# EAGLE design Dice-v1 (EAGLE 7.7.0)
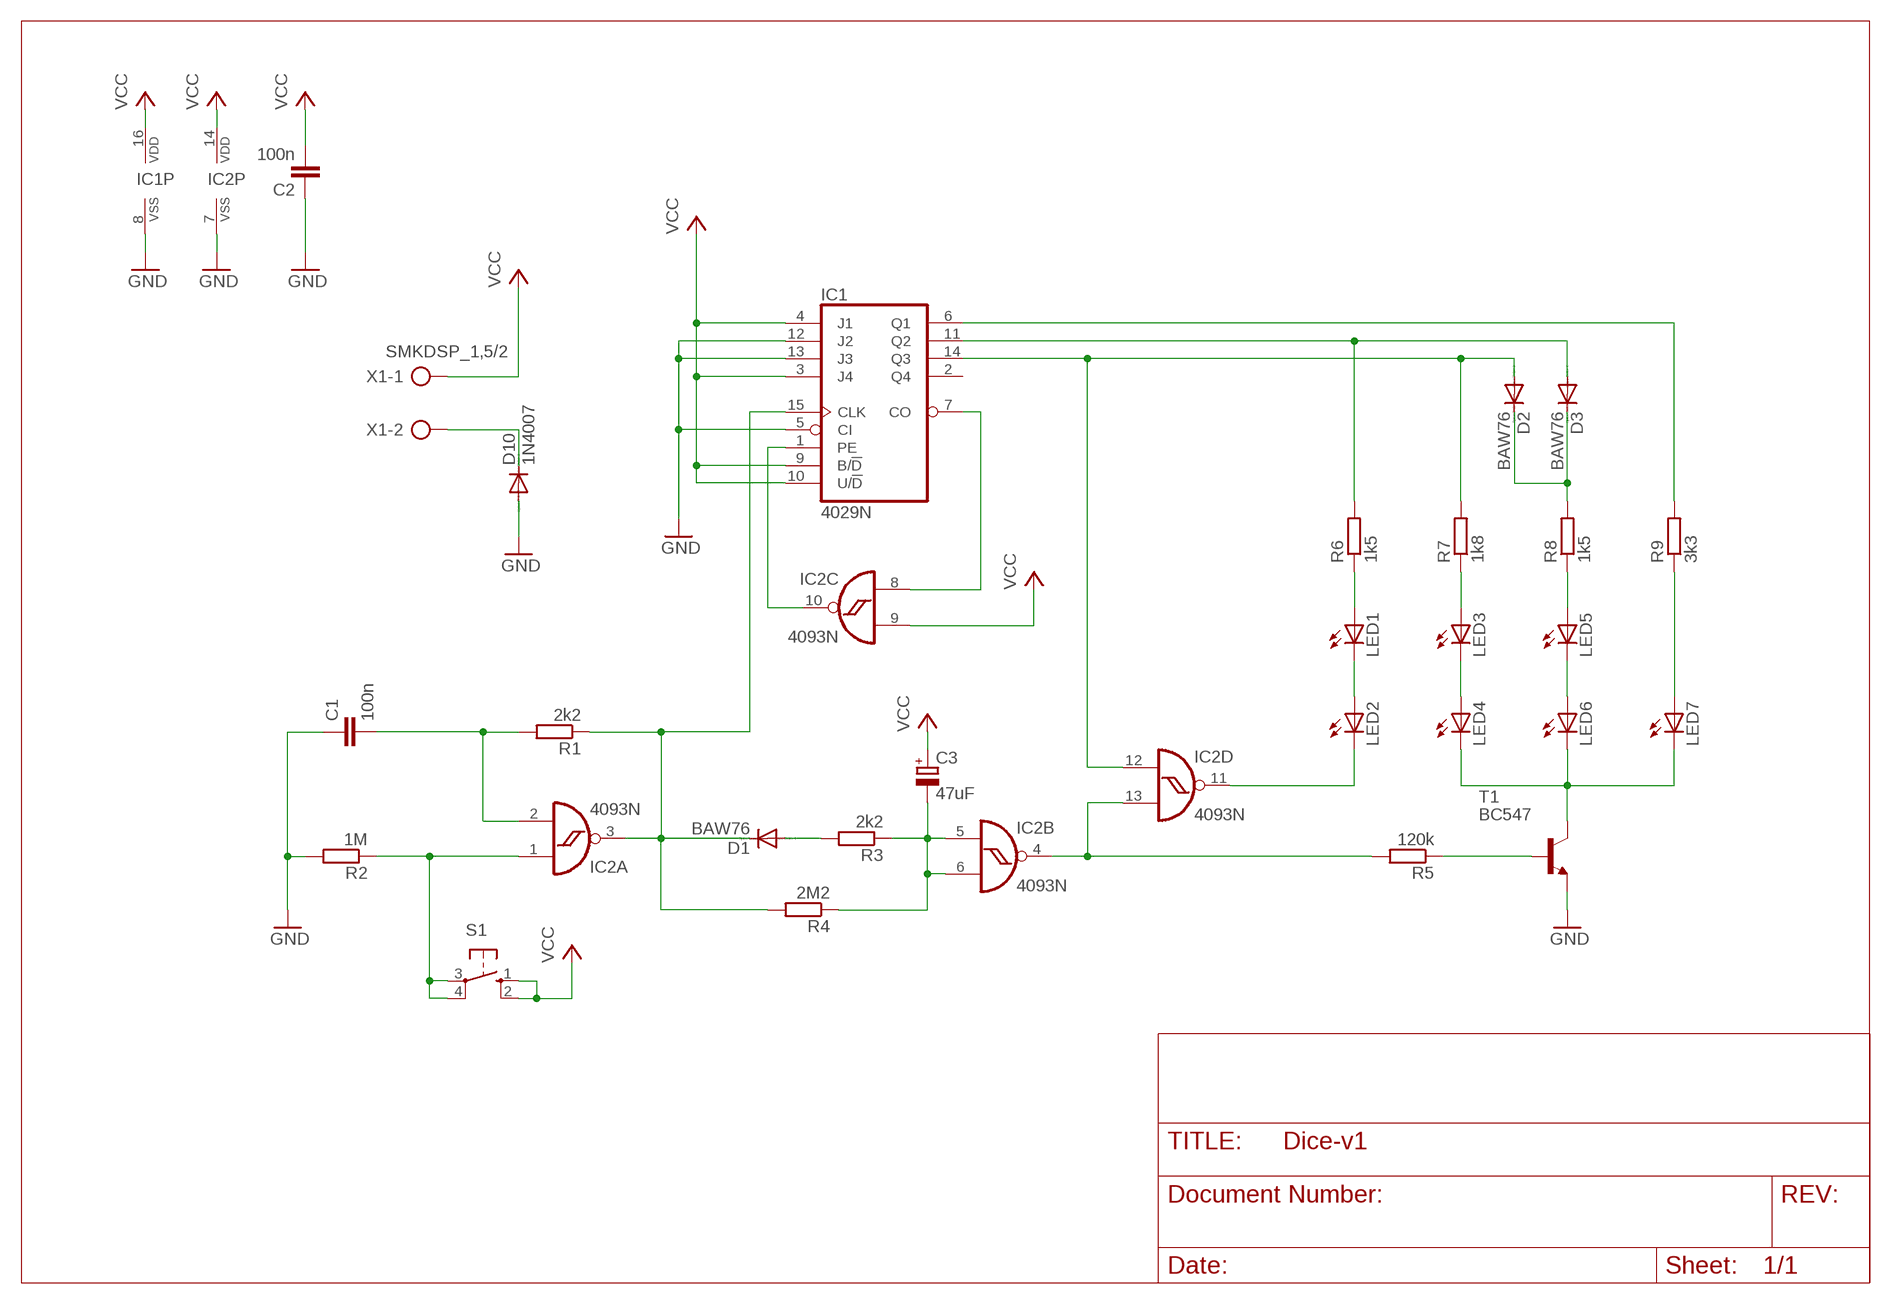
[diagram p0: schematic, sheet 1]

## Parts
C1  100n  C-EU050-025X075  [C050-025X075]
C2  100n  C-EU050-025X075  [C050-025X075]
C3  47uF  CPOL-EUE2-5  [E2-5]
D1  BAW76  BAW75  [DO35-10]
D2  BAW76  BAW75  [DO35-10]
D3  BAW76  BAW75  [DO35-10]
D10  1N4007  1N4004  [DO41-10]
IC1  4029N  [DIL16]
IC2  4093N  [DIL14]
LED1  LED5MM  [LED5MM]
LED2  LED5MM  [LED5MM]
LED3  LED5MM  [LED5MM]
LED4  LED5MM  [LED5MM]
LED5  LED5MM  [LED5MM]
LED6  LED5MM  [LED5MM]
LED7  LED5MM  [LED5MM]
R1  2k2  R-EU_0207/10  [0207/10]
R2  1M  R-EU_0207/10  [0207/10]
R3  2k2  R-EU_0207/10  [0207/10]
R4  2M2  R-EU_0207/10  [0207/10]
R5  120k  R-EU_0207/10  [0207/10]
R6  1k5  R-EU_0207/10  [0207/10]
R7  1k8  R-EU_0207/10  [0207/10]
R8  1k5  R-EU_0207/10  [0207/10]
R9  3k3  R-EU_0207/10  [0207/10]
S1  10-XX  [B3F-10XX]
T1  BC547  [TO92]
X1  SMKDSP_1,5/2  [SMKDSP_1,5/2]

## Nets
GND: C1.1 C2.1 D10.A IC1.5(CI) IC1.8(VSS) IC1.12(J2) IC1.13(J3) IC2.7(P:VSS) R2.2 T1.1(E)
N$1: C1.2 IC2.2(A:I1) R1.2
N$2: IC2.11(D:O) LED2.K(C)
N$3: LED1.K(C) LED2.A
N$4: LED4.K(C) LED6.K(C) LED7.K(C) T1.3(C)
N$5: LED3.K(C) LED4.A
N$6: LED5.K(C) LED6.A
N$7: LED1.A R6.1
N$8: LED3.A R7.1
N$9: LED5.A R8.1
N$10: LED7.A R9.1
N$11: R5.1 T1.2(B)
N$12: IC2.4(B:O) IC2.13(D:I1) R5.2
N$13: IC1.1(PE) IC2.10(C:O)
N$14: IC1.7(CO) IC2.8(C:I0)
N$15: C3.- IC2.5(B:I0) IC2.6(B:I1) R3.1 R4.1
N$16: D1.A R3.2
N$17: D1.C IC1.15(CLK) IC2.3(A:O) R1.1 R4.2
N$18: D2.C D3.C R8.2
N$19: D2.A IC1.14(Q3) IC2.12(D:I0) R7.2
N$20: D3.A IC1.11(Q2) R6.2
N$21: IC1.6(Q1) R9.2
N$22: D10.C X1.2
N$23: IC2.1(A:I0) R2.1 S1.3(P) S1.4(P1)
VCC: C2.2 C3.+ IC1.3(J4) IC1.4(J1) IC1.9(B/!D) IC1.10(U/!D) IC1.16(VDD) IC2.9(C:I1) IC2.14(P:VDD) S1.1(S) S1.2(S1) X1.1
Unconnected: IC1.2(Q4)

## Library data of the parts
C1 C2 = rcl:C-EU: CAPACITOR, European symbol
C3 = rcl:CPOL-EU: POLARIZED CAPACITOR, European symbol
D1-D3 = diode:BAW75: DIODE silicon-epitaxial planar diode
D10 = diode:1N4004: DIODE general purpose rectifier, 1 A
IC1 = 40xx:4029: Binary/decimal up/down COUNTER
IC2 = 40xx:4093: Quad 2-input NAND schmitt trigger
LED1-LED7 = led:LED: LED OSRAM: - CHIPLED LG R971, LG N971, LY N971, LG Q971, LY Q971, LO R971, LY R971 LH N974, LH R974 LS Q976, LO Q976, LY Q976 LO Q996 - Hyper CHIPLED LW Q18S LB Q993, LB Q99A, LB R99A - SideLED LS A670, LO A670, LY A670, LG A670, LP A670 LB A673, LV A673, LT A673, LW A673 LH A674 LY A675 LS A676, LA A676, LO A676, LY A676, LW A676 LS A679, LY A679, LG A679 - Hyper Micro SIDELED® LS Y876, LA Y876, LO Y876, LY Y876 LT Y87S - SmartLED LW L88C, LW L88S LB L89C, LB L89S, LG L890 LS L89K, LO L89K, LY L89K LS L896, LA L896, LO L896, LY L896 - TOPLED LS T670, LO T670, LY T670, LG T670, LP T670 LSG T670, LSP T670, LSY T670, LOP T670, LYG T670 LG T671, LOG T671, LSG T671 LB T673, LV T673, LT T673, LW T673 LH T674 LS T676, LA T676, LO T676, LY T676, LB T676, LH T676, LSB T676, LW T676 LB T67C, LV T67C, LT T67C, LS T67K, LO T67K, LY T67K, LW E67C LS E67B, LA E67B, LO E67B, LY E67B, LB E67C, LV E67C, LT E67C LW T67C LS T679, LY T679, LG T679 LS T770, LO T770, LY T770, LG T770, LP T770 LB T773, LV T773, LT T773, LW T773 LH T774 LS E675, LA E675, LY E675, LS T675 LS T776, LA T776, LO T776, LY T776, LB T776 LHGB T686 LT T68C, LB T68C - Hyper Mini TOPLED® LB M676 - Mini TOPLED Santana® LG M470 LS M47K, LO M47K, LY M47K Source: http://www.osram.convergy.de LUXEON: - LUMILED® LXK2-PW12-R00, LXK2-PW12-S00, LXK2-PW14-U00, LXK2-PW14-V00 LXK2-PM12-R00, LXK2-PM12-S00, LXK2-PM14-U00 LXK2-PE12-Q00, LXK2-PE12-R00, LXK2-PE12-S00, LXK2-PE14-T00, LXK2-PE14-U00 LXK2-PB12-K00, LXK2-PB12-L00, LXK2-PB12-M00, LXK2-PB14-N00, LXK2-PB14-P00, LXK2-PB14-Q00 LXK2-PR12-L00, LXK2-PR12-M00, LXK2-PR14-Q00, LXK2-PR14-R00 LXK2-PD12-Q00, LXK2-PD12-R00, LXK2-PD12-S00 LXK2-PH12-R00, LXK2-PH12-S00 LXK2-PL12-P00, LXK2-PL12-Q00, LXK2-PL12-R00 Source: www.luxeon.com KINGBRIGHT: KA-3528ASYC Source: www.kingbright.com
R1-R9 = rcl:R-EU_: RESISTOR, European symbol
S1 = switch-omron:10-XX: OMRON SWITCH; MPN: B3F-1000; OC_FARNELL: 176432; OC_NEWARK: 36M3542
T1 = transistor:BC547: NPN TRANSISTOR
X1 = con-phoenix-smkdsp:SMKDSP_1,5/2: Printklemme, Nennstrom: 17,5 A, Bemessungsspannung: 250 V, Raster: 5,0 mm Source: http://eshop.phoenixcontact.de .. 1733415.pdf; MF: FARNELL; MPN: 1733570; OC_FARNELL: 3041244; OC_NEWARK: 69C8588

## Board
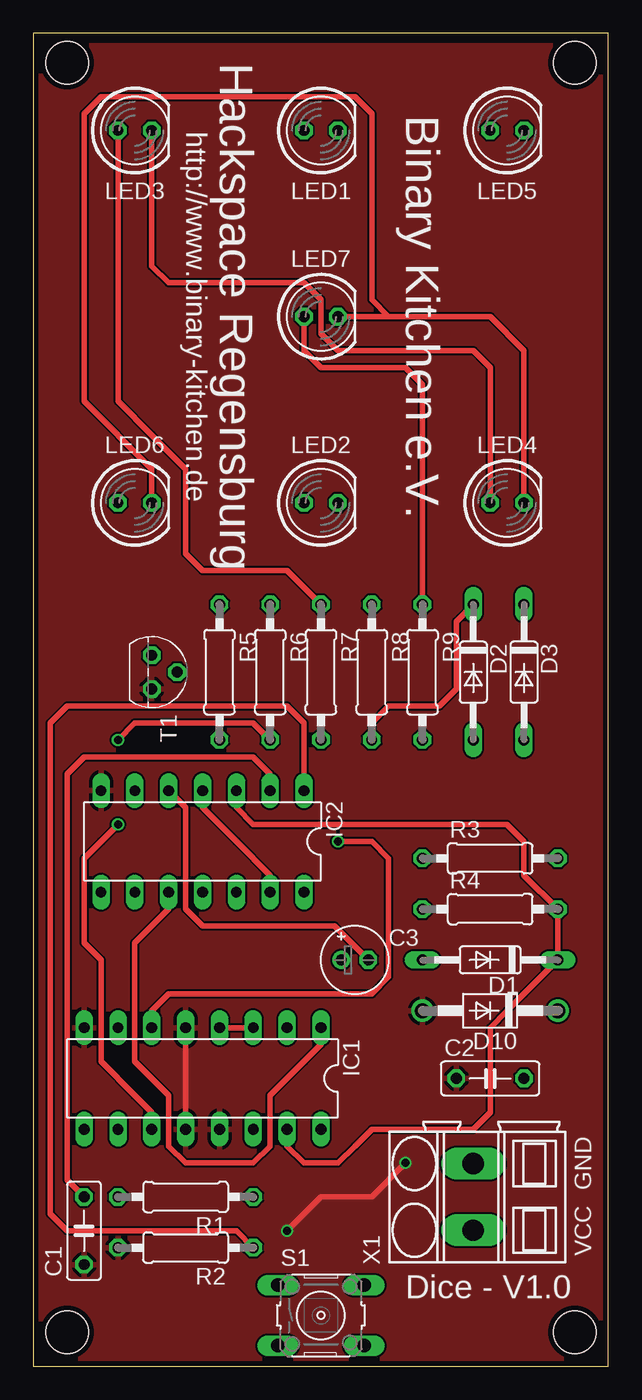
[diagram p1: board, top side]
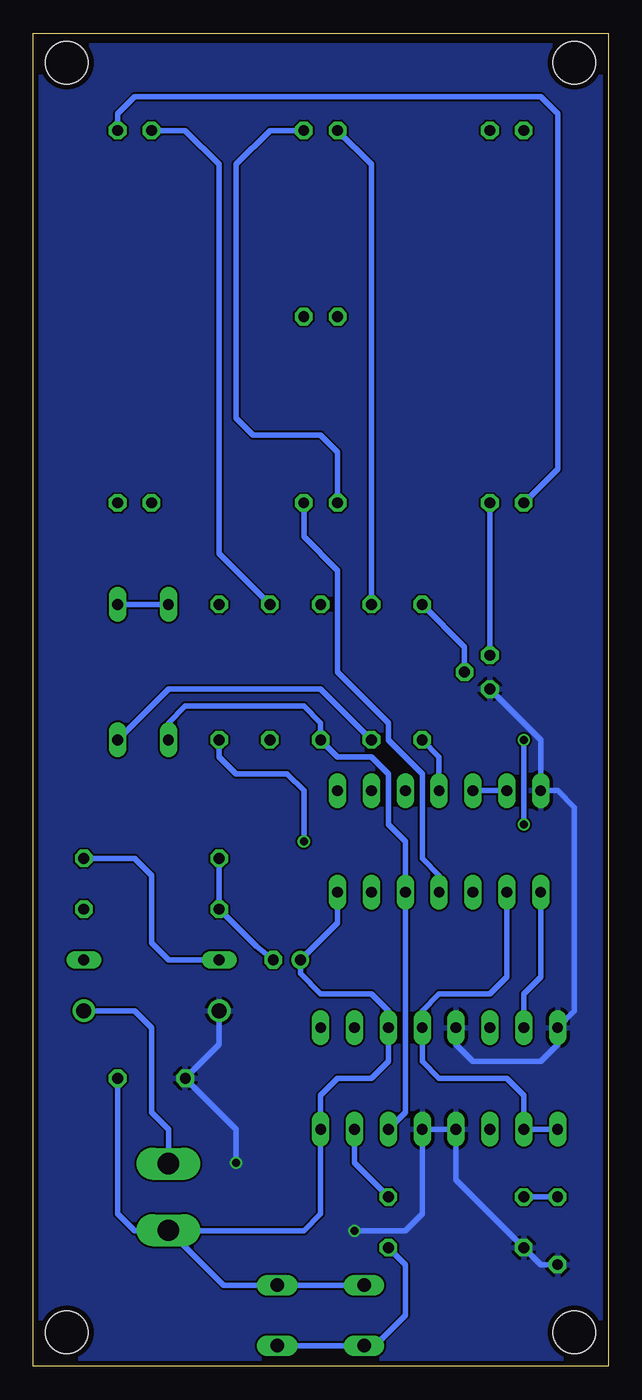
[diagram p2: board, bottom side, seen from below]

Size 43.16 x 100 mm. Coordinates in mm from the lower left corner, seen from the top.
Outline: 0,0 43.16,0 43.16,100 0,100 0,0
Copper layers (1*16): Top 0.035mm / dielectric 1.5mm / Bottom 0.035mm
Design rules "NOA Eagle Rule 2016-06-12": minimum track width 6mil, minimum drill 0.3mm, track to track 6mil, track to pad 6mil, pad to pad 6mil, via to via 6mil, smd to smd 0mil, copper to edge 0.4mm, drill to drill 10mil, minimum pad ring 10mil, minimum via ring 6mil, stop-mask expansion 2mil, vias tented up to drill 25mil, thermal gap 10mil
Holes 3.2 mm at 2.54,97.79 40.64,97.79 2.54,2.54 40.64,2.54

### Footprints (pad centres in the part's own frame; a part is rotated, then mirrored left to right if it is on the bottom)
C050-025X075 = drill 0.813 octagon: 1 -2.54,0; 2 2.54,0
E2-5 = drill 0.813 pad 1.27: + -1.016,0 | drill 0.813 pad 1.27 octagon: - 1.016,0
DO35-10 = drill 0.813 long: A 5.08,0; C -5.08,0
DO41-10 = drill 1.118: A 5.08,0; C -5.08,0
DIL16 = drill 0.813 long: 1 -8.89,-3.81; 2 -6.35,-3.81; 3 -3.81,-3.81; 4 -1.27,-3.81; 5 1.27,-3.81; 6 3.81,-3.81; 7 6.35,-3.81; 8 8.89,-3.81; 9 8.89,3.81; 10 6.35,3.81; 11 3.81,3.81; 12 1.27,3.81; 13 -1.27,3.81; 14 -3.81,3.81; 15 -6.35,3.81; 16 -8.89,3.81
DIL14 = drill 0.813 long: 1 -7.62,-3.81; 2 -5.08,-3.81; 3 -2.54,-3.81; 4 0,-3.81; 5 2.54,-3.81; 6 5.08,-3.81; 7 7.62,-3.81; 8 7.62,3.81; 9 5.08,3.81; 10 2.54,3.81; 11 0,3.81; 12 -2.54,3.81; 13 -5.08,3.81; 14 -7.62,3.81
LED5MM = drill 0.813 octagon: A -1.27,0; K 1.27,0
0207/10 = drill 0.813 octagon: 1 -5.08,0; 2 5.08,0
B3F-10XX = drill 1.016 long: 1 -3.251,2.261; 2 3.251,2.261; 3 -3.251,-2.261; 4 3.251,-2.261
TO92 = drill 0.813 octagon: 1 1.27,0; 2 0,1.905; 3 -1.27,0
SMKDSP_1,5/2 = drill 1.6 pad 1.8 long: 1 -2.5,0; 2 2.5,0

### Placement (x,y rotation side)
C1  3.81,10.16 90 top
C2  34.29,21.59 0 top
C3  24.13,30.48 0 top
D1  34.29,30.48 180 top
D2  33.02,52.07 270 top
D3  36.83,52.07 270 top
D10  34.29,26.67 180 top
IC1  12.7,21.59 180 top
IC2  12.7,39.37 180 top
LED1  21.59,92.71 0 top
LED2  21.59,64.77 0 top
LED3  7.62,92.71 0 top
LED4  35.56,64.77 0 top
LED5  35.56,92.71 0 top
LED6  7.62,64.77 0 top
LED7  21.59,78.74 0 top
R1  11.43,12.7 180 top
R2  11.43,8.89 180 top
R3  34.29,38.1 0 top
R4  34.29,34.29 0 top
R5  13.97,52.07 270 top
R6  17.78,52.07 270 top
R7  21.59,52.07 270 top
R8  25.4,52.07 270 top
R9  29.21,52.07 270 top
S1  21.59,3.81 0 top
T1  8.89,52.07 270 top
X1  33.02,12.7 90 top

### Tracks (layer width: path | path; a pad name or v marks a point on that pad's centre or on a via)
GND  (via drill 0.6)
  Top 0.406: IC1.12 IC1.5 | v19.05,10.16 21.59,12.7 25.4,12.7 v27.94,15.24
  Bottom 0.406: T1.1 5.08,46.99 IC2.7 3.81,43.18 2.54,41.91 2.54,34.29 2.54,26.67 IC1.8 3.81,24.13 5.08,22.86 10.16,22.86 11.43,24.13 IC1.5 | D10.A 29.21,24.13 C2.1 27.94,17.78 v27.94,15.24 | C1.1 5.08,7.62 R2.2 11.43,13.97 IC1.12 IC1.13 13.97,11.43 15.24,10.16 v19.05,10.16
  pour Top: 0,0 43.18,0 43.18,99.06 0,99.06
  pour Bottom: 0,0 43.18,0 43.18,99.06 0,99.06
N$1
  Top 0.406: IC2.2 17.78,44.45 16.51,45.72 3.81,45.72 2.54,44.45 2.54,41.91 2.54,13.97 C1.2
  Bottom 0.406: C1.2 R1.2
N$2
  Bottom 0.406: LED2.K 22.86,62.23 20.32,59.69 20.32,52.07 19.05,50.8 16.51,48.26 16.51,46.99 13.97,44.45 13.97,38.1 12.7,36.83 IC2.11
N$3
  Bottom 0.406: LED2.A 20.32,68.58 21.59,69.85 26.67,69.85 27.94,71.12 27.94,90.17 25.4,92.71 LED1.K
N$4
  Top 0.406: LED4.K 36.83,76.2 34.29,78.74 26.67,78.74 | 26.67,78.74 LED7.K | LED6.K 8.89,67.31 3.81,72.39 3.81,93.98 5.08,95.25 24.13,95.25 25.4,93.98 25.4,80.01 26.67,78.74
  Bottom 0.406: T1.3 LED6.K
N$5
  Top 0.406: LED4.A 34.29,74.93 33.02,76.2 22.86,76.2 21.59,77.47 21.59,80.01 20.32,81.28 10.16,81.28 8.89,82.55 LED3.K
N$6
  Bottom 0.406: LED5.K 36.83,93.98 35.56,95.25 5.08,95.25 3.81,93.98 3.81,67.31 LED6.A
N$7
  Bottom 0.406: R6.1 17.78,90.17 LED1.A
N$8
  Top 0.406: LED3.A 6.35,72.39 8.89,69.85 11.43,67.31 11.43,60.96 12.7,59.69 17.78,59.69 19.05,59.69 R7.1
N$9
  Bottom 0.406: R8.1 26.67,58.42 29.21,60.96 29.21,90.17 31.75,92.71 LED5.A
N$10
  Top 0.406: LED7.A 20.32,76.2 21.59,74.93 27.94,74.93 29.21,73.66 R9.1
N$11
  Bottom 0.406: R5.1 10.79,53.98 T1.2
N$12
  Top 0.406: IC2.4 12.7,41.91 15.24,39.37 17.78,36.83 IC2.13
  Bottom 0.406: IC2.4 12.7,45.72 R5.2
N$13
  Top 0.406: IC2.10 10.16,34.29 7.62,31.75 7.62,22.86 10.16,20.32 10.16,16.51 11.43,15.24 16.51,15.24 17.78,16.51 17.78,20.32 20.32,22.86 21.59,24.13 IC1.1
N$14
  Bottom 0.406: IC1.7 6.35,27.94 5.08,29.21 IC2.8
N$15
  Top 0.406: IC2.5 11.43,41.91 11.43,34.29 12.7,33.02 17.78,33.02 22.61,33.02 C3.-
  Bottom 0.406: IC2.6 IC2.5 | R3.1 R4.1 27.94,33.02 26.42,31.5 C3.-
N$16
  Bottom 0.406: D1.A 33.02,30.48 34.29,31.75 34.29,36.83 35.56,38.1 R3.2
N$17
  Top 0.406: IC1.15 19.05,16.51 20.32,15.24 22.86,15.24 24.13,16.51 25.4,17.78 33.02,17.78 34.29,19.05 34.29,22.86 34.29,25.4 35.56,26.67 36.83,27.94 D1.C R4.2 36.83,36.83 36.83,39.37 35.56,40.64 16.51,40.64 15.24,41.91 IC2.3
  Bottom 0.406: R1.1 19.05,15.24 IC1.15
N$18
  Top 0.406: D2.C 31.75,55.88 31.75,50.8 30.48,49.53 26.67,49.53 25.4,48.26 R8.2
  Bottom 0.406: D3.C D2.C
N$19
  Bottom 0.406: D2.A 33.02,48.26 31.75,49.53 27.94,49.53 22.86,49.53 21.59,48.26 R7.2 20.32,45.72 17.78,45.72 16.51,44.45 16.51,40.64 15.24,39.37 IC2.12 15.24,19.05 IC1.14
N$20  (via drill 0.6)
  Top 0.406: R6.2 16.51,48.26 7.62,48.26 v6.35,46.99 | v6.35,40.64 5.08,39.37 3.81,38.1 3.81,36.83 3.81,31.75 5.08,30.48 5.08,22.86 7.62,20.32 8.89,19.05 IC1.11
  Bottom 0.406: D3.A 33.02,50.8 25.4,50.8 21.59,50.8 R6.2 | v6.35,46.99 v6.35,40.64
N$21  (via drill 0.6)
  Top 0.406: IC1.6 8.89,26.67 10.16,27.94 25.4,27.94 26.67,29.21 26.67,38.1 25.4,39.37 v22.86,39.37
  Bottom 0.406: v22.86,39.37 22.86,43.18 24.13,44.45 27.94,44.45 29.21,45.72 R9.2
N$22
  Bottom 0.406: X1.2 33.02,17.78 34.29,19.05 34.29,25.4 35.56,26.67 D10.C
N$23
  Top 0.406: IC2.1 20.32,48.26 19.05,49.53 2.54,49.53 1.27,48.26 1.27,11.43 2.54,10.16 15.24,10.16 R2.1
  Bottom 0.406: S1.4 S1.3 17.5,1.55 15.24,3.81 15.24,7.62 R2.1
VCC
  Top 0.406: IC1.4 IC1.3
  Bottom 0.406: X1.1 33.06,10.16 35.56,10.16 36.83,11.43 C2.2 | X1.1 28.89,6.07 S1.2 S1.1 | IC1.9 IC1.10 6.35,20.32 7.62,21.59 12.7,21.59 13.97,22.86 IC1.4 13.97,26.67 12.7,27.94 8.89,27.94 7.62,29.21 IC2.9 | X1.1 32.98,10.16 22.86,10.16 21.59,11.43 IC1.16 21.59,20.32 20.32,21.59 17.78,21.59 16.51,22.86 IC1.3 16.51,26.67 17.78,27.94 21.59,27.94 23.11,29.46 C3.+ 20.32,33.27 IC2.14

### Text on the board
tNames: http://www.binary-kitchen.de | Hackspace Regensburg | Binary Kitchen e.V. | GND | VCC | Dice - V1.0